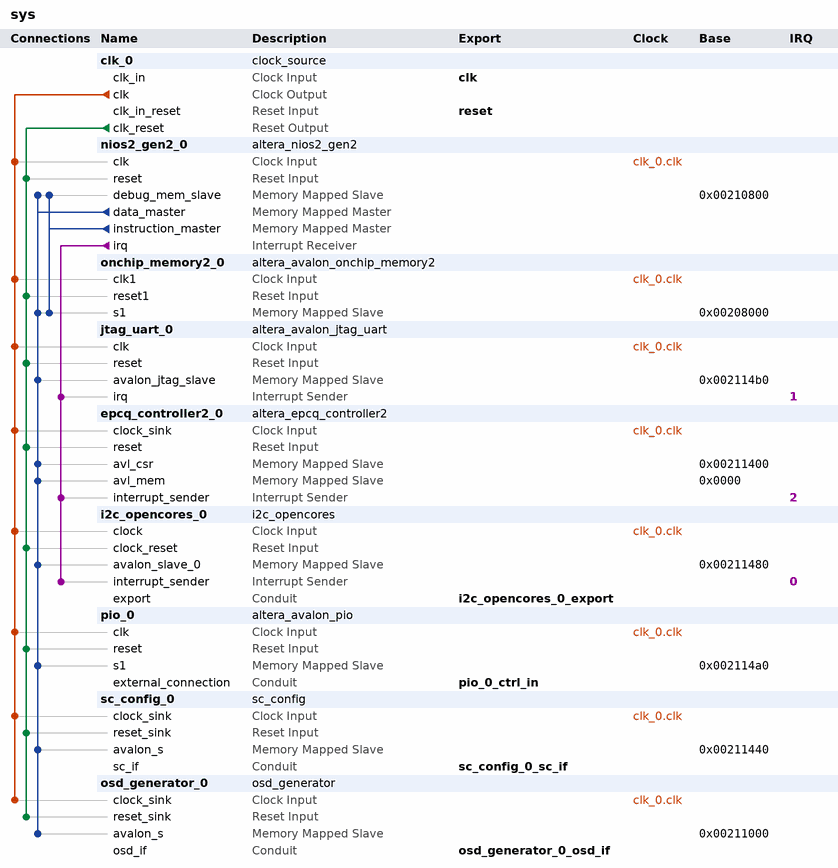
[diagram p0: system contents]
# Platform Designer (Qsys) system sys, Cyclone 10 LP 10CL025YE144C8G
# Parameters at their usual value, and those the tool derives, are not listed.
package require -exact qsys 21.1
create_system sys
set_project_property DEVICE_FAMILY {Cyclone 10 LP}
set_project_property DEVICE 10CL025YE144C8G

add_instance clk_0 clock_source 21.1
set_instance_parameter_value clk_0 clockFrequency 25000000

add_instance nios2_gen2_0 altera_nios2_gen2 21.1
set_instance_parameter_value nios2_gen2_0 dcache_size 2048
set_instance_parameter_value nios2_gen2_0 exceptionSlave onchip_memory2_0.s1
set_instance_parameter_value nios2_gen2_0 icache_size 4096
set_instance_parameter_value nios2_gen2_0 impl Tiny
set_instance_parameter_value nios2_gen2_0 resetSlave onchip_memory2_0.s1

add_instance onchip_memory2_0 altera_avalon_onchip_memory2 21.1
set_instance_parameter_value onchip_memory2_0 dataWidth 32
set_instance_parameter_value onchip_memory2_0 dualPort false
set_instance_parameter_value onchip_memory2_0 initMemContent true
set_instance_parameter_value onchip_memory2_0 initializationFileName onchip_mem.hex
set_instance_parameter_value onchip_memory2_0 memorySize 18432

add_instance jtag_uart_0 altera_avalon_jtag_uart 21.1
set_instance_parameter_value jtag_uart_0 readBufferDepth 32
set_instance_parameter_value jtag_uart_0 simInteractiveOptions NO_INTERACTIVE_WINDOWS
set_instance_parameter_value jtag_uart_0 useRegistersForReadBuffer true
set_instance_parameter_value jtag_uart_0 useRegistersForWriteBuffer true
set_instance_parameter_value jtag_uart_0 writeBufferDepth 32

add_instance epcq_controller2_0 altera_epcq_controller2 21.1
set_instance_parameter_value epcq_controller2_0 CHIP_SELS 1
set_instance_parameter_value epcq_controller2_0 DDASI 0
set_instance_parameter_value epcq_controller2_0 FLASH_TYPE EPCQ16
set_instance_parameter_value epcq_controller2_0 IO_MODE STANDARD
set_instance_parameter_value epcq_controller2_0 clkFreq 25000000

add_instance i2c_opencores_0 i2c_opencores 17.1
set_instance_parameter_value i2c_opencores_0 dedicated_spi 0

add_instance pio_0 altera_avalon_pio 21.1
set_instance_parameter_value pio_0 direction Input
set_instance_parameter_value pio_0 width 32

add_instance sc_config_0 sc_config 1.0

add_instance osd_generator_0 osd_generator 1.0

# connections
add_connection clk_0.clk epcq_controller2_0.clock_sink clock
add_connection clk_0.clk i2c_opencores_0.clock clock
add_connection clk_0.clk jtag_uart_0.clk clock
add_connection clk_0.clk nios2_gen2_0.clk clock
add_connection clk_0.clk onchip_memory2_0.clk1 clock
add_connection clk_0.clk osd_generator_0.clock_sink clock
add_connection clk_0.clk pio_0.clk clock
add_connection clk_0.clk sc_config_0.clock_sink clock
add_connection clk_0.clk_reset epcq_controller2_0.reset reset
add_connection clk_0.clk_reset i2c_opencores_0.clock_reset reset
add_connection clk_0.clk_reset jtag_uart_0.reset reset
add_connection clk_0.clk_reset nios2_gen2_0.reset reset
add_connection clk_0.clk_reset onchip_memory2_0.reset1 reset
add_connection clk_0.clk_reset osd_generator_0.reset_sink reset
add_connection clk_0.clk_reset pio_0.reset reset
add_connection clk_0.clk_reset sc_config_0.reset_sink reset
add_connection nios2_gen2_0.data_master epcq_controller2_0.avl_csr avalon
set_connection_parameter_value nios2_gen2_0.data_master/epcq_controller2_0.avl_csr baseAddress 0x00211400
add_connection nios2_gen2_0.data_master epcq_controller2_0.avl_mem avalon
set_connection_parameter_value nios2_gen2_0.data_master/epcq_controller2_0.avl_mem baseAddress 0x0000
add_connection nios2_gen2_0.data_master i2c_opencores_0.avalon_slave_0 avalon
set_connection_parameter_value nios2_gen2_0.data_master/i2c_opencores_0.avalon_slave_0 baseAddress 0x00211480
add_connection nios2_gen2_0.data_master jtag_uart_0.avalon_jtag_slave avalon
set_connection_parameter_value nios2_gen2_0.data_master/jtag_uart_0.avalon_jtag_slave baseAddress 0x002114b0
add_connection nios2_gen2_0.data_master nios2_gen2_0.debug_mem_slave avalon
set_connection_parameter_value nios2_gen2_0.data_master/nios2_gen2_0.debug_mem_slave baseAddress 0x00210800
add_connection nios2_gen2_0.data_master onchip_memory2_0.s1 avalon
set_connection_parameter_value nios2_gen2_0.data_master/onchip_memory2_0.s1 baseAddress 0x00208000
add_connection nios2_gen2_0.data_master osd_generator_0.avalon_s avalon
set_connection_parameter_value nios2_gen2_0.data_master/osd_generator_0.avalon_s baseAddress 0x00211000
add_connection nios2_gen2_0.data_master pio_0.s1 avalon
set_connection_parameter_value nios2_gen2_0.data_master/pio_0.s1 baseAddress 0x002114a0
add_connection nios2_gen2_0.data_master sc_config_0.avalon_s avalon
set_connection_parameter_value nios2_gen2_0.data_master/sc_config_0.avalon_s baseAddress 0x00211440
add_connection nios2_gen2_0.instruction_master nios2_gen2_0.debug_mem_slave avalon
set_connection_parameter_value nios2_gen2_0.instruction_master/nios2_gen2_0.debug_mem_slave baseAddress 0x00210800
add_connection nios2_gen2_0.instruction_master onchip_memory2_0.s1 avalon
set_connection_parameter_value nios2_gen2_0.instruction_master/onchip_memory2_0.s1 baseAddress 0x00208000
add_connection nios2_gen2_0.irq epcq_controller2_0.interrupt_sender interrupt
set_connection_parameter_value nios2_gen2_0.irq/epcq_controller2_0.interrupt_sender irqNumber 2
add_connection nios2_gen2_0.irq i2c_opencores_0.interrupt_sender interrupt
set_connection_parameter_value nios2_gen2_0.irq/i2c_opencores_0.interrupt_sender irqNumber 0
add_connection nios2_gen2_0.irq jtag_uart_0.irq interrupt
set_connection_parameter_value nios2_gen2_0.irq/jtag_uart_0.irq irqNumber 1

# exported interfaces
add_interface clk clock sink
set_interface_property clk EXPORT_OF clk_0.clk_in
add_interface i2c_opencores_0_export conduit end
set_interface_property i2c_opencores_0_export EXPORT_OF i2c_opencores_0.export
add_interface osd_generator_0_osd_if conduit end
set_interface_property osd_generator_0_osd_if EXPORT_OF osd_generator_0.osd_if
add_interface pio_0_ctrl_in conduit end
set_interface_property pio_0_ctrl_in EXPORT_OF pio_0.external_connection
add_interface reset reset sink
set_interface_property reset EXPORT_OF clk_0.clk_in_reset
add_interface sc_config_0_sc_if conduit end
set_interface_property sc_config_0_sc_if EXPORT_OF sc_config_0.sc_if

set_interconnect_requirement {$system} qsys_mm.clockCrossingAdapter HANDSHAKE
set_interconnect_requirement {$system} qsys_mm.enableEccProtection FALSE
set_interconnect_requirement {$system} qsys_mm.insertDefaultSlave FALSE
set_interconnect_requirement {$system} qsys_mm.maxAdditionalLatency 1

save_system sys.qsys
